# Altium schematic sheet XeCanBang.SchDoc
size A
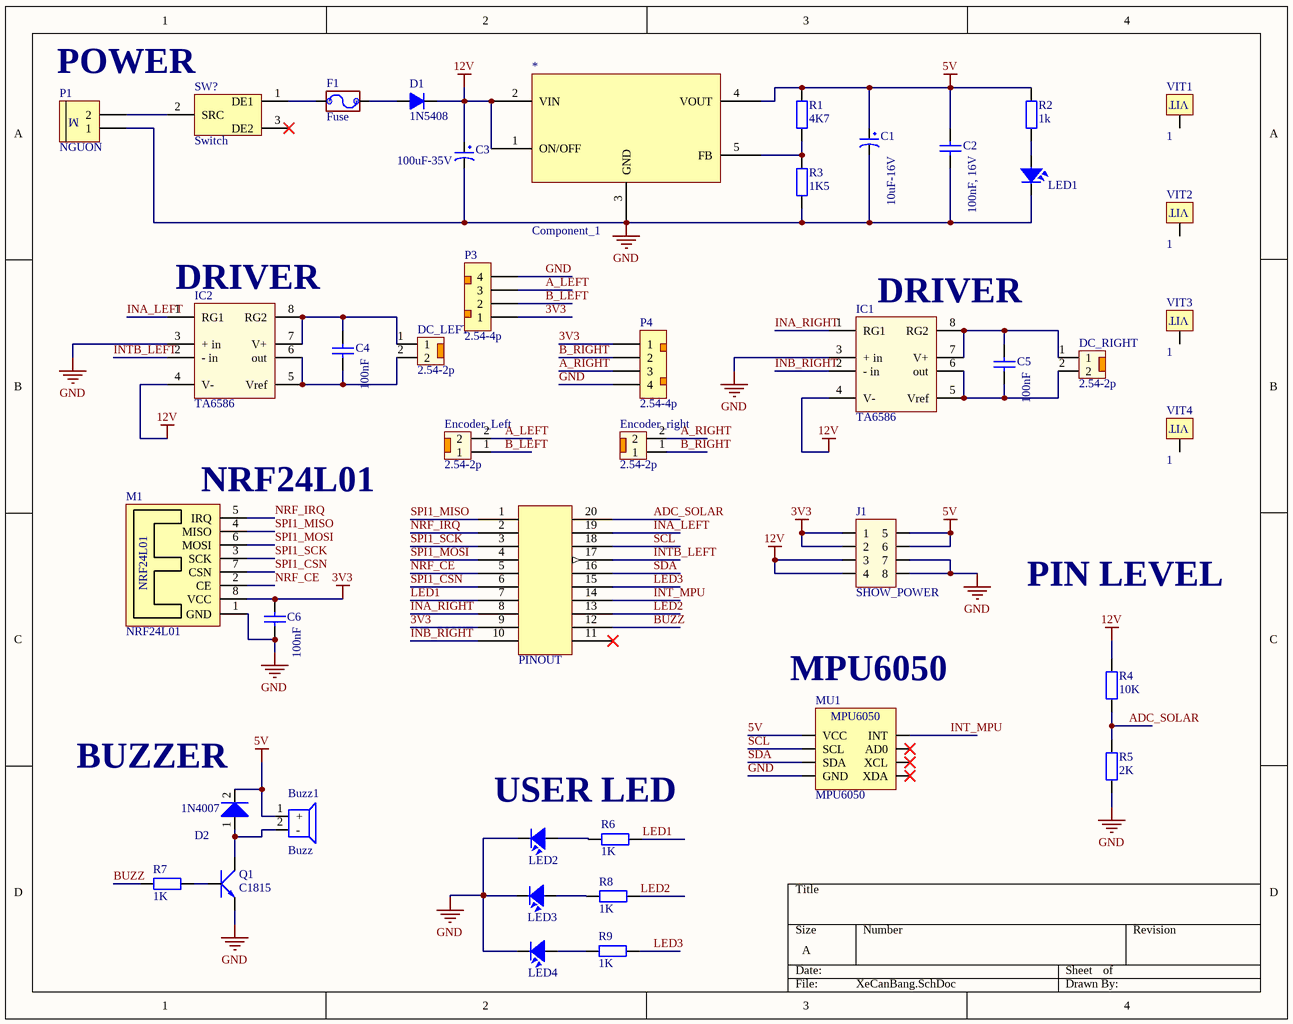
[diagram p0: XeCanBang.SchDoc]

## Parts
*  Component_1  [MIC]
Buzz1  Buzz  [Buzz]
C1  10uF-16V  [tu hoa 4mm]
C2  value 100nF, 16V  [CAPNTO2.54-3.05x1.78A]  (hidden comment: 5AK220KABAA)
C3  100uF-35V  [tu hoa 6.5mm]
C4  value 100nF  [CAPNTO2.54-3.05x1.78A]  (hidden comment: 5AK220KABAA)
C5  value 100nF  [CAPNTO2.54-3.05x1.78A]  (hidden comment: 5AK220KABAA)
C6  value 100nF  [CAPNTO2.54-3.05x1.78A]  (hidden comment: 5AK220KABAA)
D1  1N5408  [D5A]
D2  1N4007  [1N4007]
DC_LEFT  2.54-2p  [Header Duc Thang 2P 2.54]
DC_RIGHT  2.54-2p  [Header Duc Thang 2P 2.54]
Encoder_Left  2.54-2p  [Header Duc Thang 2P 2.54]
Encoder_right  2.54-2p  [Header Duc Thang 2P 2.54]
F1  Fuse  [FUSE_BOX]
IC1  TA6586  [DIP8/W0.3]
IC2  TA6586  [DIP8/W0.3]
J1  SHOW_POWER  [JP4x2]
JP1  PINOUT  [HDR2X10]
LED1  LED  [LED-3]  (value not drawn)
LED2  LED  [LED-3]  (value not drawn)
LED3  LED  [LED-3]  (value not drawn)
LED4  LED  [LED-3]  (value not drawn)
M1  NRF24L01  [NRF24L01]
MU1  MPU6050  [MPU6050]
P1  NGUON  [Medium - Header 2]
P3  2.54-4p  [Header Duc Thang 4p 2.54]
P4  2.54-4p  [Header Duc Thang 4p 2.54]
Q1  C1815  [QTO-92]
R1  4K7  [R1/4W]
R2  1k  [R1/4W]
R3  1K5  [R1/4W]
R4  10K  [R1/4W]
R5  2K  [R1/4W]
R6  1K  [R1/4W]
R7  1K  [R1/4W]
R8  1K  [R1/4W]
R9  1K  [R1/4W]
SW?  Switch  [Switch]
VIT1  1  [VIT]
VIT2  1  [VIT]
VIT3  1  [VIT]
VIT4  1  [VIT]

## Nets
3V3: C6.1 J1.1 J1.2 JP1.9 M1.8(VCC) P3.1 P4.1
5V: *.4(VOUT) Buzz1.1(+) C1.1 C2.1 D2.2(K) J1.5 J1.6 MU1.1(VCC) R1.2 R2.2
12V: *.1(ON/OFF) *.2(VIN) C3.1 D1.2(K) IC1.4(V-) IC2.4(V-) J1.3 J1.4 R4.2
GND: *.3(GND) C1.2 C2.2 C3.2 C6.2 IC1.3(+_in) IC2.3(+_in) J1.7 J1.8 LED1.2 LED2.2 LED3.2 LED4.2 M1.1(GND) MU1.2(GND) P1.1 P3.4 P4.4 Q1.1(E) R3.1 R5.1
A_LEFT: Encoder_Left.2 P3.3
A_RIGHT: Encoder_right.2 P4.3
ADC_SOLAR: JP1.20 R4.1 R5.2
B_LEFT: Encoder_Left.1 P3.2
B_RIGHT: Encoder_right.1 P4.2
BUZZ: JP1.12 R7.1
INA_LEFT: IC2.1(RG1) JP1.19
INA_RIGHT: IC1.1(RG1) JP1.8
INB_RIGHT: IC1.2(-_in) JP1.10
INT_MPU: JP1.14 MU1.8(INT)
INTB_LEFT: IC2.2(-_in) JP1.17
LED1: JP1.7 R6.2
LED2: JP1.13 R8.2
LED3: JP1.15 R9.2
NRF_CE: JP1.5 M1.2(CE)
NRF_IRQ: JP1.2 M1.5(IRQ)
SCL: JP1.18 MU1.3(SCL)
SDA: JP1.16 MU1.4(SDA)
SPI1_CSN: JP1.6 M1.7(CSN)
SPI1_MISO: JP1.1 M1.4(MISO)
SPI1_MOSI: JP1.4 M1.6(MOSI)
SPI1_SCK: JP1.3 M1.3(SCK)
Net*_5: *.5(FB) R1.1 R3.2
NetBuzz1_2: Buzz1.2(-) D2.1(A) Q1.2(C)
NetC4_1: C4.1 DC_LEFT.1 IC2.7(V+) IC2.8(RG2)
NetC4_2: C4.2 DC_LEFT.2 IC2.5(Vref) IC2.6(out)
NetC5_1: C5.1 DC_RIGHT.1 IC1.7(V+) IC1.8(RG2)
NetC5_2: C5.2 DC_RIGHT.2 IC1.5(Vref) IC1.6(out)
NetD1_1: D1.1(A) F1.2
NetF1_1: F1.1 SW?.1(DE1)
NetLED1_1: LED1.1 R2.1
NetLED2_1: LED2.1 R6.1
NetLED3_1: LED3.1 R8.1
NetLED4_1: LED4.1 R9.1
NetP1_2: P1.2 SW?.2(SRC)
NetQ1_3: Q1.3(B) R7.2

Not connected (* = marked no-connect by the designer): JP1 11(13)*; MU1 5(XDA)* 6(XCL)* 7(AD0)*; SW? 3(DE2)* 4 5; VIT1 VIT1(1); VIT2 VIT1(1); VIT3 VIT1(1); VIT4 VIT1(1)

## Notes on the sheet
- POWER
- (near IC2) DRIVER
- (near IC1) DRIVER
- (near M1) NRF24L01
- PIN LEVEL
- MPU6050
- (near D2) BUZZER
- USER LED
- (in symbol Header 2 - M) M

## Library data of the parts
C1 = Tu Hoa 10uF 16V 4x7: Cắm; So_Chan: 2; Don_Vi: Con; Ten_Linh_Kien: Tụ Hóa 10uF 16V; Ma_Hang: MH006855; Chung_Loai: Cắm; Kieu_Chan: *
C2 C4-C6 = 5AK220KABAA: CAP NPO CAPNTO 22pF 100V 10%; ComponentLink1Description: Datasheet; ComponentLink1URL: D:\Dropbox\Datasheets\Passive Components\Capacitors\AVX Disc Ceramic Capacitors.pdf; Unit Price: 0.003
C3 = Tu Hoa 100uF 35V 6x8: Cắm; Don_Vi: Con; So_Chan: 2; Ten_Linh_Kien: Tụ Hóa 100uF 35V; Ma_Hang: MH006862; Chung_Loai: Cắm; Kieu_Chan: *
D1 = D5A: Diode 5A; Value: 1N5408
D2 = 1N4007: Diode LS 1A 1000V DO-41; ComponentLink1Description: Datasheet; ComponentLink1URL: D:\Dropbox\Datasheets\Diodes and Rectifiers\Diodes\1N400X.pdf; Unit Price: 0.0072
DC_LEFT DC_RIGHT Encoder_Left Encoder_right = Header 2.54-2p Duc Thang: Cắm; So_Chan: 2; Don_Vi: Con; Ten_Linh_Kien: Header 2P XH2.54-2P Đực Thẳng; Ma_Hang: MH001283; Chung_Loai: Cắm; Kieu_Chan: *
IC1 IC2 = INA118: Precision, Low Power  INSTRUMENTATION AMPLIFIER; Value: INA118; Designed by: VanDungEvn
J1 = Jump Doi Duc 2.54_4Px2: Cắm; Ten_Linh_Kien: Jump Đơn Đực 2.54MM 1x40P Thẳng 11MM; Ma_Hang: MH000903; Don_Vi: Con; Ghi_Chu: *; Kieu_Chan: *; Chung_Loai: Cắm
JP1 = Jump Doi Duc 2.54_10x2: Cắm; Ten_Linh_Kien: Jump Đôi Đực 2.54MM 2x40P Thẳng 11MM; Don_Vi: Con; Ma_Hang: MH002686; Ghi_Chu: *; Kieu_Chan: *; Chung_Loai: Cắm
LED1-LED4 = LED: LED Single colour Green and Red; Value: LED 3 ly Single Colour
MU1 = MPU6050: Manufacturer: W¨¹rth Elektronik eiSos GmbH; partNo: 613004143121; ComponentLink1 Description: Manufacturer; ComponentLink2 Description: Datasheet; NoPins: 04; Created Date: 29 March 2013; ComponentLink1URL: http://www.we-online.com; ComponentLink2URL: http://katalog.we-online.de/em/datasheet/6130xx143121.pdf; Created by: Karrer Zheng
P1 = Header 2 - M: Header, 2-Pin, Medium; LatestRevisionDate: 17-Jul-2002; LatestRevisionNote: Re-released for DXP Platform.; Publisher: Altium Limited
P3 P4 = Header 2.54_4p Duc Thang: Cắm; Don_Vi: Con; So_Chan: 4; Ten_Linh_Kien: Header 4P XH2.54-4P Đực Thẳng; Ma_Hang: MH001285; Chung_Loai: Cắm; Kieu_Chan: *
Q1 = C1815: NPN 600mW, ECB; Value: C1815
R1-R9 = R1/4W: Resistor 1/4W; Value: R1/4W - 1K
VIT1-VIT4 = VIT: Oc Vit